# Altium schematic sheet Sensors.SchDoc
size A4
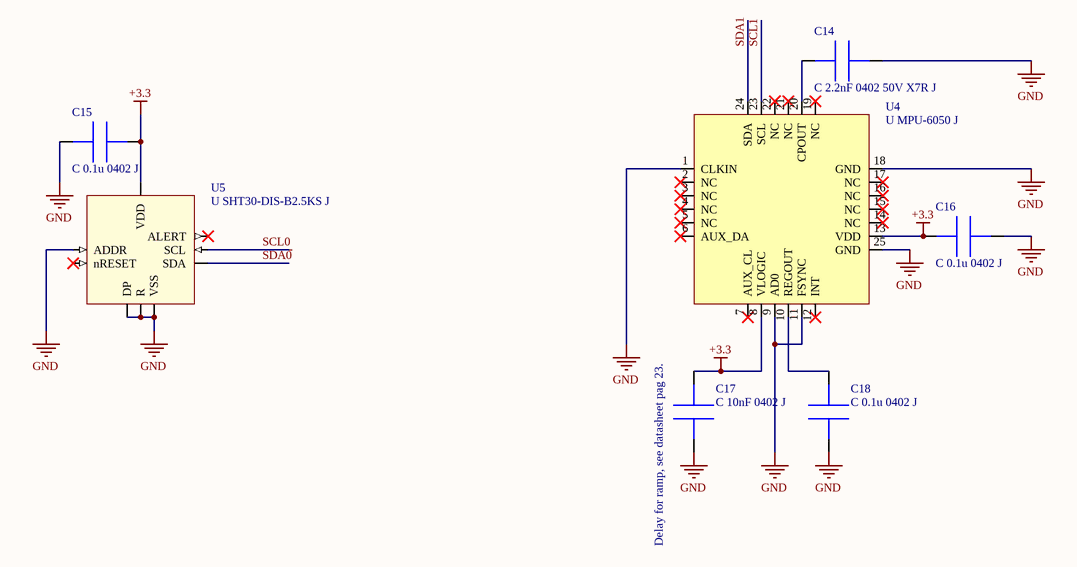
[diagram p0: Sensors.SchDoc]

## Parts
C14  C 2.2nF 0402 50V X7R J  [C0402]
C15  C 0.1u 0402 J  [C0402]
C16  C 0.1u 0402 J  [C0402]
C17  C 10nF 0402 J  [C0402]
C18  C 0.1u 0402 J  [C0402]
U4  U MPU-6050 J  [MPU-6050]
U5  U SHT30-DIS-B2.5KS J  [SHT30]

## Nets
+3.3: C15.2 C16.1 C17.2 U4.8(VLOGIC) U4.13(VDD) U5.5(VDD)
GND: C14.2 C15.1 C16.2 C17.1 C18.1 U4.1(CLKIN) U4.9(AD0) U4.11(FSYNC) U4.18(GND) U4.25(GND) U5.2(ADDR) U5.7(R) U5.8(VSS) U5.DP
SCL0: U5.4(SCL)
SCL1: U4.23(SCL)
SDA~{0}: U5.1(SDA)
SDA1: U4.24(SDA)
NetC14_1: C14.1 U4.20(CPOUT)
NetC18_2: C18.2 U4.10(REGOUT)

Not connected (* = marked no-connect by the designer): U4 2(NC)* 3(NC)* 4(NC)* 5(NC)* 6(AUX_DA)* 7(AUX_CL)* 12(INT)* 14(NC)* 15(NC)* 16(NC)* 17(NC)* 19(NC)* 21(NC)* 22(NC)*; U5 3(ALERT)* 6(nRESET)*

## Notes on the sheet
- Delay for ramp, see datasheet pag 23.

## Library data of the parts
C14 = C 2.2nF 0402 50V X7R J: Cap Ceramic 0.0022uF 50V X7R 10% Pad SMD 0402 125C Automotive T/R AC0402KRX7R9BB222; Manufacturer: Yageo; Supplier 1: Newark; Manufacturer Part Number: AC0402KRX7R9BB222; RoHS: Yes; Category: Ceramic Capacitors; Stock 1: 49560; Pricing 1: 10=0,03200, 25=0,02600, 50=0,02100, 100=0,01600 (USD); Mount: Surface Mount; Case/Package: 0402; Case Code (Imperial): 0402; Case Code (Metric): 1005; Min Operating Temperature: -55°C; Max Operating Temperature: 125°C; Packaging: Tape and Reel; Capacitance: 2.2nF; Tolerance: 10%; Voltage Rating: 50V; Ratings: AEC-Q200; RoHS Compliant: Yes; ComponentLink1URL: http://www.yageo.com/documents/recent/UPY-AC_NP0X7R_16V-to-630V_11.pdf?src-supplier=Digi-Key; ComponentLink1Description: http://www.yageo.com/documents/recent/UPY-AC_NP0X7R_16V-to-630V_11.pdf?src-supplier=Digi-Key; ComponentLink2URL: https://www.yageo.com/upload/media/product/productsearch/datasheet/mlcc/UPY-AC_NP0X7R_16V-to-630V_12.pdf?src-supplier=Digi-Key; ComponentLink2Description: https://www.yageo.com/upload/media/product/productsearch/datasheet/mlcc/UPY-AC_NP0X7R_16V-to-630V_12.pdf?src-supplier=Digi-Key; Supplier 2: Digi-Key; Stock 2: 49626; Pricing 2: 1=0,10000, 10=0,05000, 50=0,02700, 100=0,02210, 500=0,01576, 1000=0,01239, 2500=0,01126, 5000=0,01036 (USD); Supplier 3: Mouser; Stock 3: 49159; Pricing 3: 1=0,10000, 10=0,05600, 50=0,05600, 100=0,02500, 1000=0,01400, 10000=0,01000 (USD); JLCPCB: C309129; Supplier Part Number 1: 69AH6526; Supplier Part Number 2: 311-3072-1-ND; Supplier Part Number 3: 603-AC402KRX7R9BB222
C15 C16 C18 = C 0.1u 0402 J: Cap Ceramic 0.1uF 50V X7R 10% Pad SMD 0402 125C Low ESR Automotive CL05B104KB54PNC; Manufacturer: Samsung; Supplier 1: Digi-Key; Manufacturer Part Number: CL05B104KB54PNC; RoHS: Yes; Category: Ceramic Capacitors; Stock 1: 3863336; Pricing 1: 1=0,10000, 10=0,04600, 50=0,02500, 100=0,02040, 500=0,01460, 1000=0,01147, 2500=0,01043, 5000=0,00959 (USD); RoHS Compliant: Yes; Supplier Part Number 1: 1276-CL05B104KB54PNCCT-ND; JLCPCB: C307331
C17 = C 10nF 0402 J: Ceramic capacitor SMD-0402 10nF /50V X7R# K +-10%, Samsung, RoHS CL05B103KB5NNNC; Tolerance: 10%; Voltage Rating: 50V; Dielectric: X7R; Supplier 1: Arrow Electronics; Manufacturer: Samsung; Manufacturer Part Number: CL05B103KB5NNNC; RoHS: Yes; Category: Ceramic Capacitors; Stock 1: 6530000; Pricing 1: 10000=0,00290, 20000=0,00230, 50000=0,00210, 100000=0,00190 (USD); Mount: Surface Mount; Case/Package: 0402; Case Code (Metric): 1005; Case Code (Imperial): 0402; Material: Ceramic; Contact Plating: Tin; Min Operating Temperature: -55°C; Max Operating Temperature: 125°C; Packaging: Tape and Reel; Capacitance: 10nF; Package Quantity: 1; Voltage: 50V; Voltage Rating (DC): 50V; Series: CL; Construction: Flat; Length: 1mm; Width: 0.02inch; Height: 0.5mm; Thickness: 0.022inch; Depth: 0.5mm; Radiation Hardening: No; Lead Free: Lead Free; RoHS Compliant: Yes; ComponentLink1URL: https://datasheet.ciiva.com/15195/getdatasheetpartid-359682-15195636.pdf?src-supplier=Verical; ComponentLink1Description: https://datasheet.ciiva.com/15195/getdatasheetpartid-359682-15195636.pdf?src-supplier=Verical; ComponentLink2URL: https://datasheet.ciiva.com/29198/458761-da-01-en-vs-kondensator-0402-29198432.pdf?src-supplier=Conrad; ComponentLink2Description: https://datasheet.ciiva.com/29198/458761-da-01-en-vs-kondensator-0402-29198432.pdf?src-supplier=Conrad; ComponentLink3URL: https://datasheet.ciiva.com/26309/mlcc-catalogdownload2013-eng-26309005.pdf?src-supplier=Distrelec; ComponentLink3Description: https://datasheet.ciiva.com/26309/mlcc-catalogdownload2013-eng-26309005.pdf?src-supplier=Distrelec; Supplier 2: Digi-Key; Stock 2: 14692768; Pricing 2: 1=0,10000, 10=0,01500, 50=0,00820, 100=0,00670, 500=0,00478, 1000=0,00375, 2500=0,00341, 5000=0,00314 (USD); Supplier 3: Mouser; Stock 3: 2909879; Pricing 3: 1=0,10000, 10=0,00900, 50=0,00900, 100=0,00700, 500=0,00600, 1000=0,00500, 2500=0,00400, 10000=0,00300, 20000=0,00200 (USD); Supplier Part Number 1: CL05B103KB5NNNC; Supplier Part Number 2: 1276-1028-1-ND; Supplier Part Number 3: 187-CL05B103KB5NNNC; JLCPCB: C15195
U4 = U MPU-6050 J: IMU ACCEL/GYRO 3-AXIS I2C 24QFN; Manufacturer: TDK InvenSense; Sensor Type: Accelerometer,Gyroscope,3 Axis; Supplier 1: Avnet; Manufacturer Part Number: MPU-6050; RoHS: Yes; Category: Inertial Measurement Units (IMUs); Pricing 1: 5000=3,94760, 10000=3,89200, 20000=3,78080, 30000=3,69740, 40000=3,55840, 50000=3,47500, 500000=3,39160 (USD); Mount: Surface Mount; Case/Package: QFN; Min Operating Temperature: -40°C; Max Operating Temperature: 85°C; Packaging: Tape and Reel; Output Type: I2C; Series: -; RoHS Compliant: Yes; ComponentLink1URL: https://datasheet.ciiva.com/1513/1788002-1513632.pdf?src-supplier=Element14; ComponentLink1Description: https://datasheet.ciiva.com/1513/1788002-1513632.pdf?src-supplier=Element14; ComponentLink2URL: https://datasheet.ciiva.com/22731/1788002-22731434.pdf?src-supplier=Element14; ComponentLink2Description: https://datasheet.ciiva.com/22731/1788002-22731434.pdf?src-supplier=Element14; JLCPCB: C24112; Supplier Part Number 1: MPU-6050
U5 = U SHT30-DIS-B2.5KS J: Humidity/Temperature Sensor Digital Serial (I2C) 8-Pin DFN EP T/R SHT30-DIS-B2.5KS; Manufacturer: Sensirion; Supplier 1: Arrow Electronics; Manufacturer Part Number: SHT30-DIS-B2.5KS; RoHS: Yes; Category: Temperature and Humidity Sensors; Stock 1: 90000; Pricing 1: 2500=1,79820 (USD); RoHS Compliant: Yes; ComponentLink1URL: https://media.digikey.com/pdf/Data%20Sheets/Sensirion%20PDFs/HT_DS_SHT3x_DIS.pdf?src-supplier=Digi-Key; ComponentLink1Description: https://media.digikey.com/pdf/Data%20Sheets/Sensirion%20PDFs/HT_DS_SHT3x_DIS.pdf?src-supplier=Digi-Key; Supplier 2: Digi-Key; Stock 2: 10530; Pricing 2: 1=3,98000, 5=3,51000, 10=3,10000, 25=2,51560, 50=2,22300, 100=2,16450, 500=1,81350, 1000=1,69650 (USD); Supplier 3: Mouser; Stock 3: 49374; Pricing 3: 1=3,86000, 10=2,45000, 50=2,45000, 100=2,25000, 500=1,90000, 1000=1,78000, 2500=1,71000, 5000=1,57000, 10000=1,55000, 25000=1,52000 (USD); JLCPCB: C77361; Supplier Part Number 1: SHT30-DIS-B2.5KS; Supplier Part Number 2: 1649-1009-1-ND; Supplier Part Number 3: 403-SHT30-DIS-B